# Altium schematic sheet Schematic.SchDoc
size A
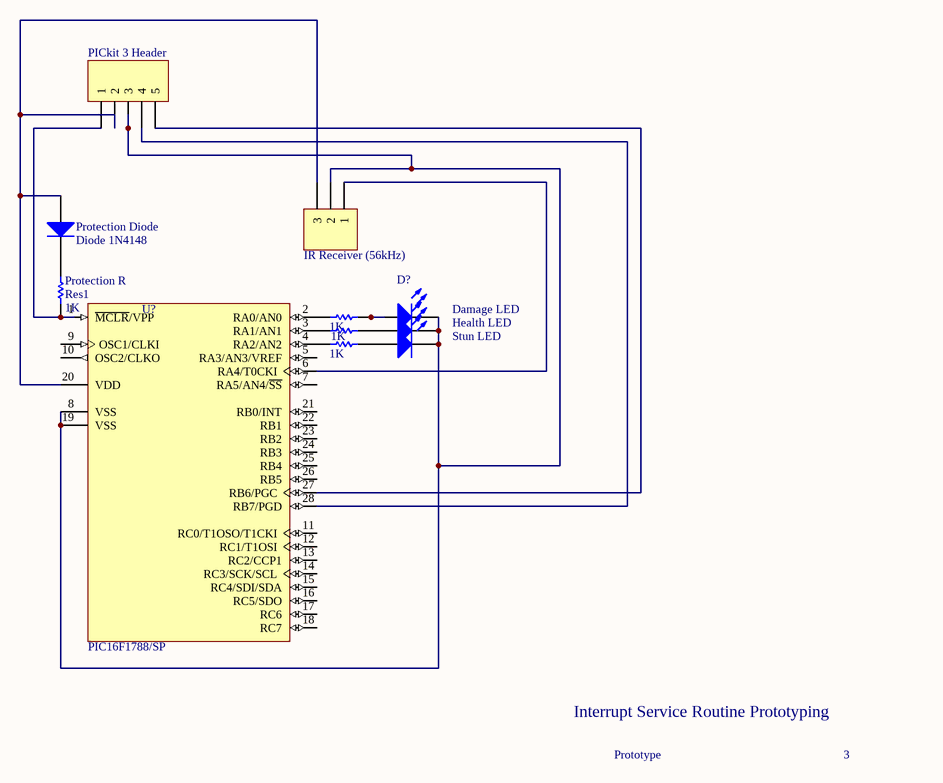
[diagram p0: Schematic.SchDoc]

## Parts
(Parts that share a designator on the sheet are numbered #1, #2 ... from top to bottom, then left to right.)
?#1  value 1K  [AXIAL-0.3]
?#2  value 1K  [AXIAL-0.3]
?#3  Health LED  [LED-0]
?#4  value 1K  [AXIAL-0.3]
?#5  Stun LED  [LED-0]
D?  Damage LED  [LED-0]
IR_Receiver_(56kHz)  (no value)  [HDR1X3H]
PICkit_3_Header  (no value)  [HDR1X5]
Protection_Diode  Diode 1N4148  [DO-35]
Protection_R  Res1  value 1K  [AXIAL-0.3]
U?  PIC16F1788/SP  [SPDIP300-SP28]

## Nets
Net?#1_1: ?#1.1 U?.2(RA0/AN0)
Net?#1_2: ?#1.2 D?.1(A)
Net?#2_1: ?#2.1 U?.3(RA1/AN1)
Net?#2_2: ?#2.2 ?#3.1(A)
Net?#3_2: ?#3.2(K) ?#5.2(K) D?.2(K) IR_Receiver_(56kHz).2 PICkit_3_Header.3 U?.8(VSS) U?.19(VSS)
Net?#4_1: ?#4.1 U?.4(RA2/AN2)
Net?#4_2: ?#4.2 ?#5.1(A)
NetIR_Receiver_(56kHz)_1: IR_Receiver_(56kHz).1 U?.6(RA4/T0CKI)
NetIR_Receiver_(56kHz)_3: IR_Receiver_(56kHz).3 PICkit_3_Header.2 Protection_Diode.1(A) U?.20(VDD)
NetPICkit_3_Header_1: PICkit_3_Header.1 Protection_R.1 U?.1(~{MCLR}/VPP)
NetPICkit_3_Header_4: PICkit_3_Header.4 U?.28(RB7/PGD)
NetPICkit_3_Header_5: PICkit_3_Header.5 U?.27(RB6/PGC)
NetProtection_Diode_2: Protection_Diode.2(K) Protection_R.2

Not connected (* = marked no-connect by the designer): U? 5(RA3/AN3/VREF) 7(RA5/AN4/~{SS}) 9(OSC1/CLKI) 10(OSC2/CLKO) 11(RC0/T1OSO/T1CKI) 12(RC1/T1OSI) 13(RC2/CCP1) 14(RC3/SCK/SCL) 15(RC4/SDI/SDA) 16(RC5/SDO) 17(RC6) 18(RC7) 21(RB0/INT) 22(RB1) 23(RB2) 24(RB3) 25(RB4) 26(RB5)

## Notes on the sheet
- Interrupt Service Routine Prototyping
- Prototype
- 3

## Library data of the parts
?#1 ?#2 ?#4 Protection_R = Res1: Resistor; Published: 8-Jun-2000; LatestRevisionDate: 17-Jul-2002; LatestRevisionNote: Re-released for DXP Platform.; PackageReference: AXIAL-0.3; Publisher: Altium Limited; PackageDescription: Axial Device, Thru-Hole; 2 Leads; 0.3 in Pin Spacing
?#3 ?#5 D? = LED0: Typical INFRARED GaAs LED; Published: 8-Jun-2000; LatestRevisionDate: 08-Jul-2005; LatestRevisionNote: Mech Layer 1 removed.; PackageReference: LED-0; Publisher: Altium Limited; PackageDescription: LED; 2 Leads
IR_Receiver_(56kHz) = Header 3H: Header, 3-Pin, Right Angle; LatestRevisionDate: 17-Jul-2002; LatestRevisionNote: Re-released for DXP Platform.; Publisher: Altium Limited
PICkit_3_Header = Header 5: Header, 5-Pin; LatestRevisionDate: 17-Jul-2002; LatestRevisionNote: Re-released for DXP Platform.; Publisher: Altium Limited
Protection_Diode = Diode 1N4148: High Conductance Fast Diode; Published: 8-Jun-2000; LatestRevisionDate: 17-Jul-2002; LatestRevisionNote: Re-released for DXP Platform.; DatasheetVersion: 1997; PackageReference: DO-35; Publisher: Altium Limited; PackageDescription: Diode, Axial; Body 3.8 x 1.9 mm (LxDia. max), Lead Dia. 0.53 mm (max); Code_JEDEC: DO-204-AH; ComponentLink1Description: Manufacturer Link; ComponentLink1URL: http://www.fairchildsemi.com/; ComponentLink2Description: Datasheet; ComponentLink2URL: http://www.fairchildsemi.com/ds/1N%2F1N4148.pdf
U? = PIC16F72-I/SP: 8-Bit CMOS FLASH Microcontroller with A/D Converter, 2K (x14-Bit words) FLASH, 128 Bytes RAM, 28-Pin PDIP 300mil, Standard VDD Range, Industrial Temperature; Published: 11-Oct-2004; LatestRevisionDate: 29-Jan-2009; LatestRevisionNote: Sch. layout revised. 3D Model Removed.; DatasheetVersion: revC, Jan-2007; PackageVersion: revBB, Aug-2009; PackageReference: SPDIP300-SP28; Publisher: Altium Limited; PackageDescription: 28-Lead Skinny Plastic Dual In-Line (SP) - 300 mil Body [SPDIP]; Supplier 1: Digi-Key; Supplier Part Number 1: PIC16F72-I/SP-ND; Supplier 2: Farnell; Supplier Part Number 2: 9760636; ComponentLink1Description: Datasheet; ComponentLink1URL: http://ww1.microchip.com/downloads/en/DeviceDoc/39597C.pdf; ComponentLink2Description: Packaging Specification; ComponentLink2URL: http://www.microchip.com/stellent/groups/techpub_sg/documents/packagingspec/en012702.pdf; ComponentLink3Description: Microchip.com Home; ComponentLink3URL: http://www.microchip.com/